# EAGLE design gondola_test (EAGLE 5.07)
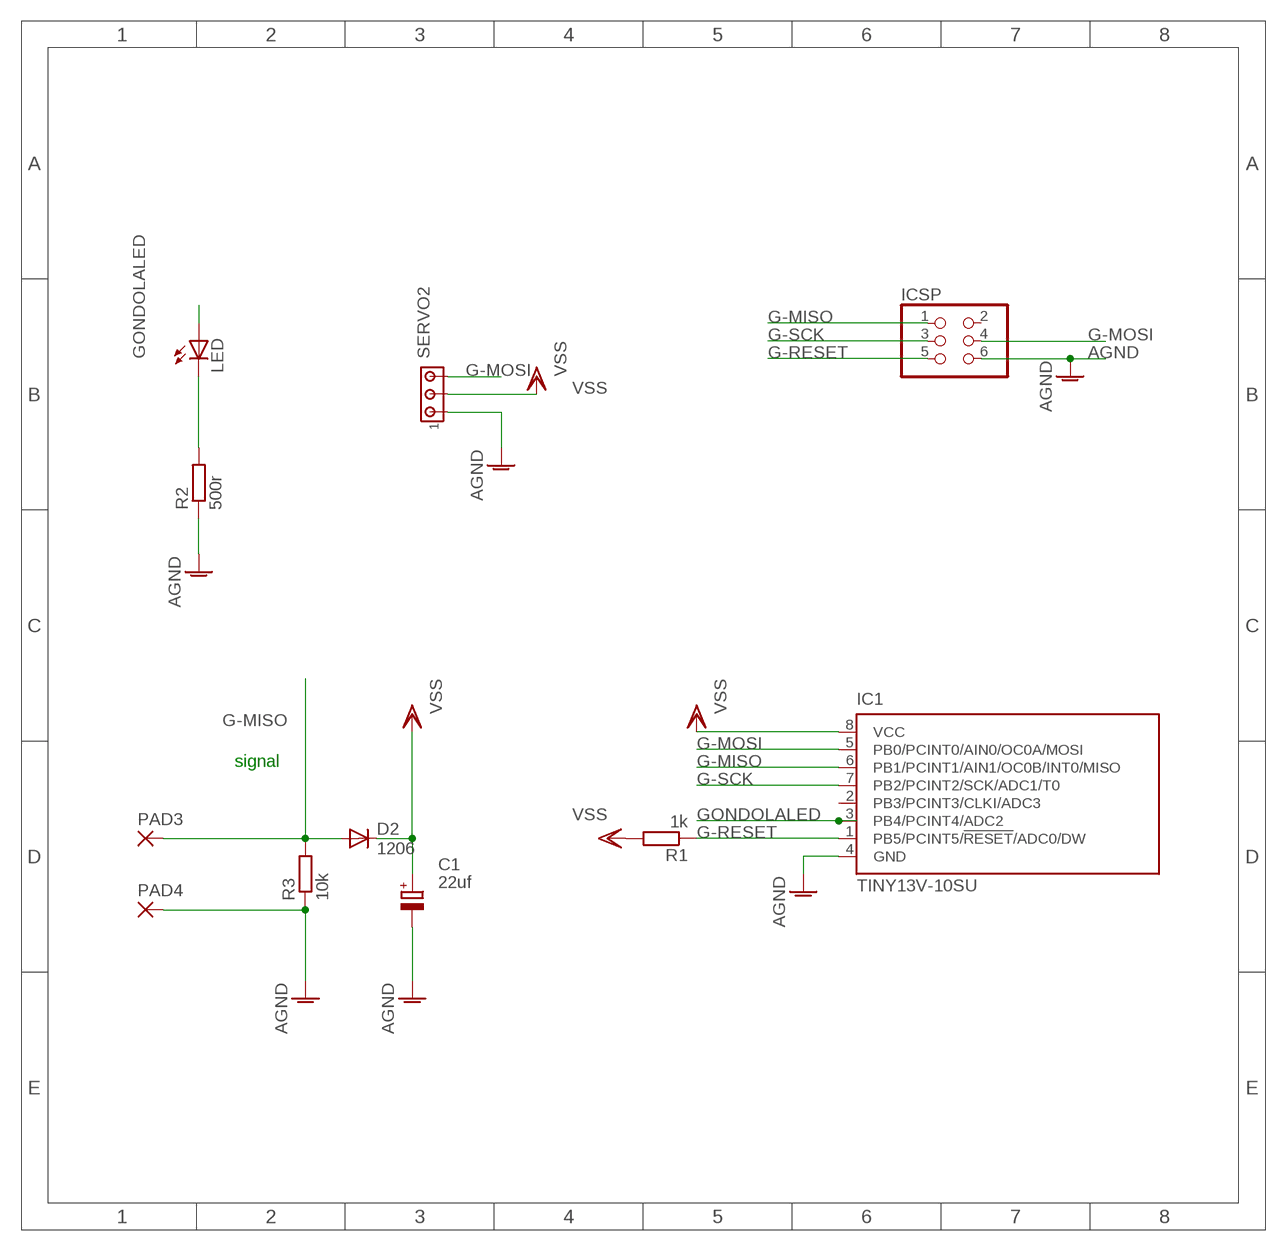
[diagram p0: schematic, sheet 1]

## Parts
C1  22uf  CPOL-EU140CLH-1014  [140CLH-1014]
D2  1206  DIODE-GF1  [GF1]
IC1  TINY13V-10SU  [8S2]
ICSP  PINHD-2X3  [2X03]
LED  LEDSMT1206  [1206]
PAD3  3,17/1,3  [3,17/1,3]
PAD4  3,17/1,3  [3,17/1,3]
R1  1k  R-EU_R1206  [R1206]
R2  500r  R-EU_R1206  [R1206]
R3  10k  R-EU_R1206  [R1206]
SERVO2  MTA03-100  [10X03MTA]

## Nets
AGND [power]: C1.- IC1.4(GND) ICSP.6 PAD4.1(P) R2.1 R3.1 SERVO2.1
G-MISO: D2.A IC1.6(PB1/PCINT1/AIN1/OC0B/INT0/MISO) ICSP.1 PAD3.1(P) R3.2
G-MOSI: IC1.5(PB0/PCINT0/AIN0/OC0A/MOSI) ICSP.4 SERVO2.3
G-RESET: IC1.1(PB5/PCINT5/!RESET!/ADC0/DW) ICSP.5 R1.1
G-SCK: IC1.7(PB2/PCINT2/SCK/ADC1/T0) ICSP.3
GONDOLALED: IC1.3(PB4/PCINT4/ADC2) LED.A
N$1: LED.C R2.2
VSS: C1.+ D2.C IC1.8(VCC) R1.2 SERVO2.2
Unconnected: IC1.2(PB3/PCINT3/CLKI/ADC3) ICSP.2

## Notes on the sheet
- signal

## Library data of the parts
C1 = rcl:CPOL-EU: POLARIZED CAPACITOR, European symbol
D2 = matt diode:DIODE-: DIODE
IC1 = atmel:TINY13: 8-bit AVR Microcontroller with 1K Bytes In-System Programmable Flash Source: http://www.atmel.com/dyn/resources/prod_documents/2535S.pdf; MPN: ATTINY13V-10SU; OC_FARNELL: 9171584; OC_NEWARK: 96K6524
ICSP = pinhead:PINHD-2X3: PIN HEADER
LED = matt led:LED: LED OSRAM: - CHIPLED LG R971, LG N971, LY N971, LG Q971, LY Q971, LO R971, LY R971 LH N974, LH R974 LS Q976, LO Q976, LY Q976 LO Q996 - Hyper CHIPLED LW Q18S LB Q993, LB Q99A, LB R99A - SideLED LS A670, LO A670, LY A670, LG A670, LP A670 LB A673, LV A673, LT A673, LW A673 LH A674 LY A675 LS A676, LA A676, LO A676, LY A676, LW A676 LS A679, LY A679, LG A679 - Hyper Micro SIDELED® LS Y876, LA Y876, LO Y876, LY Y876 LT Y87S - SmartLED LW L88C, LW L88S LB L89C, LB L89S, LG L890 LS L89K, LO L89K, LY L89K LS L896, LA L896, LO L896, LY L896 - TOPLED LS T670, LO T670, LY T670, LG T670, LP T670 LSG T670, LSP T670, LSY T670, LOP T670, LYG T670 LG T671, LOG T671, LSG T671 LB T673, LV T673, LT T673, LW T673 LH T674 LS T676, LA T676, LO T676, LY T676, LB T676, LH T676, LSB T676, LW T676 LB T67C, LV T67C, LT T67C, LS T67K, LO T67K, LY T67K, LW E67C LS E67B, LA E67B, LO E67B, LY E67B, LB E67C, LV E67C, LT E67C LW T67C LS T679, LY T679, LG T679 LS T770, LO T770, LY T770, LG T770, LP T770 LB T773, LV T773, LT T773, LW T773 LH T774 LS E675, LA E675, LY E675, LS T675 LS T776, LA T776, LO T776, LY T776, LB T776 LHGB T686 LT T68C, LB T68C - Hyper Mini TOPLED® LB M676 - Mini TOPLED Santana® LG M470 LS M47K, LO M47K, LY M47K Source: http://www.osram.convergy.de LUXEON: - LUMILED® LXK2-PW12-R00, LXK2-PW12-S00, LXK2-PW14-U00, LXK2-PW14-V00 LXK2-PM12-R00, LXK2-PM12-S00, LXK2-PM14-U00 LXK2-PE12-Q00, LXK2-PE12-R00, LXK2-PE12-S00, LXK2-PE14-T00, LXK2-PE14-U00 LXK2-PB12-K00, LXK2-PB12-L00, LXK2-PB12-M00, LXK2-PB14-N00, LXK2-PB14-P00, LXK2-PB14-Q00 LXK2-PR12-L00, LXK2-PR12-M00, LXK2-PR14-Q00, LXK2-PR14-R00 LXK2-PD12-Q00, LXK2-PD12-R00, LXK2-PD12-S00 LXK2-PH12-R00, LXK2-PH12-S00 LXK2-PL12-P00, LXK2-PL12-Q00, LXK2-PL12-R00 Source: www.luxeon.com KINGBRIGHT: KA-3528ASYC Source: www.kingbright.com
PAD3 PAD4 = wirepad:3,17/1,3: THROUGH-HOLE PAD
R1-R3 = matt rcl:R-EU_: RESISTOR, European symbol
SERVO2 = matt con-amp:MTA03-100: AMP connector

## Net classes
1 power: width 3 mm

## Board
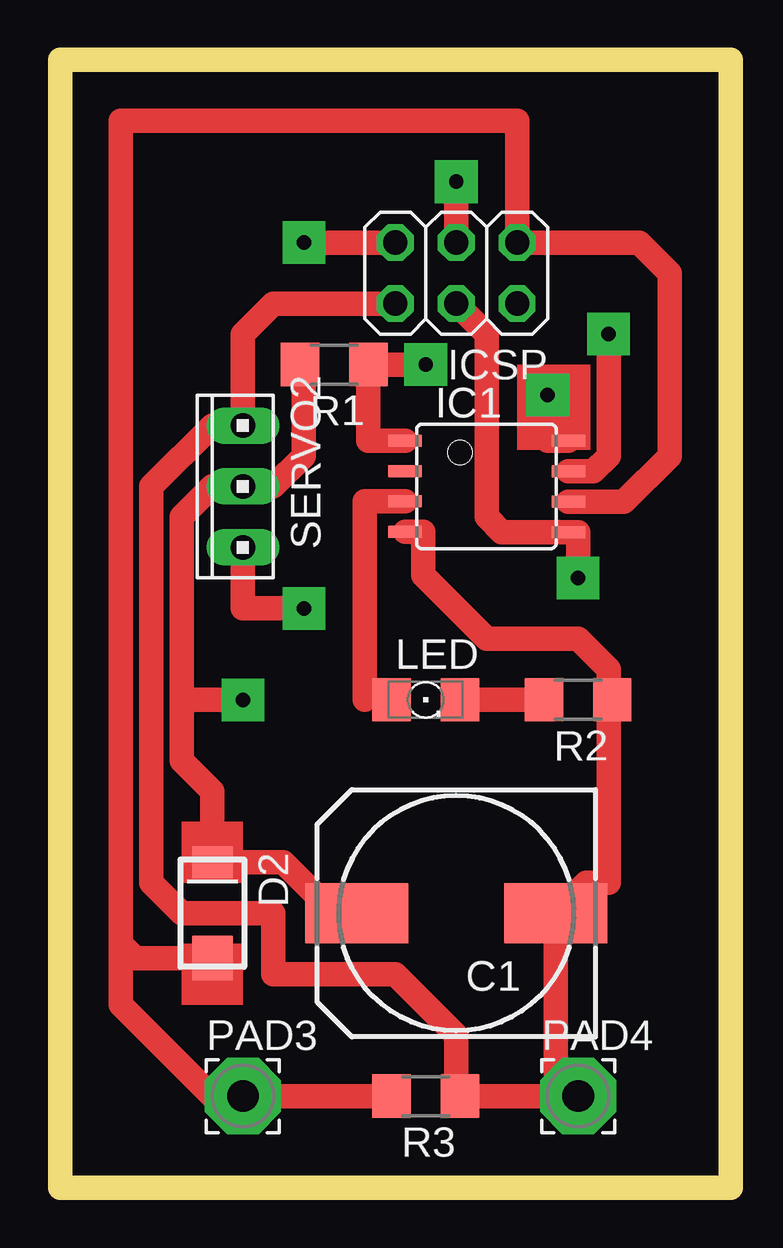
[diagram p1: board, top side]
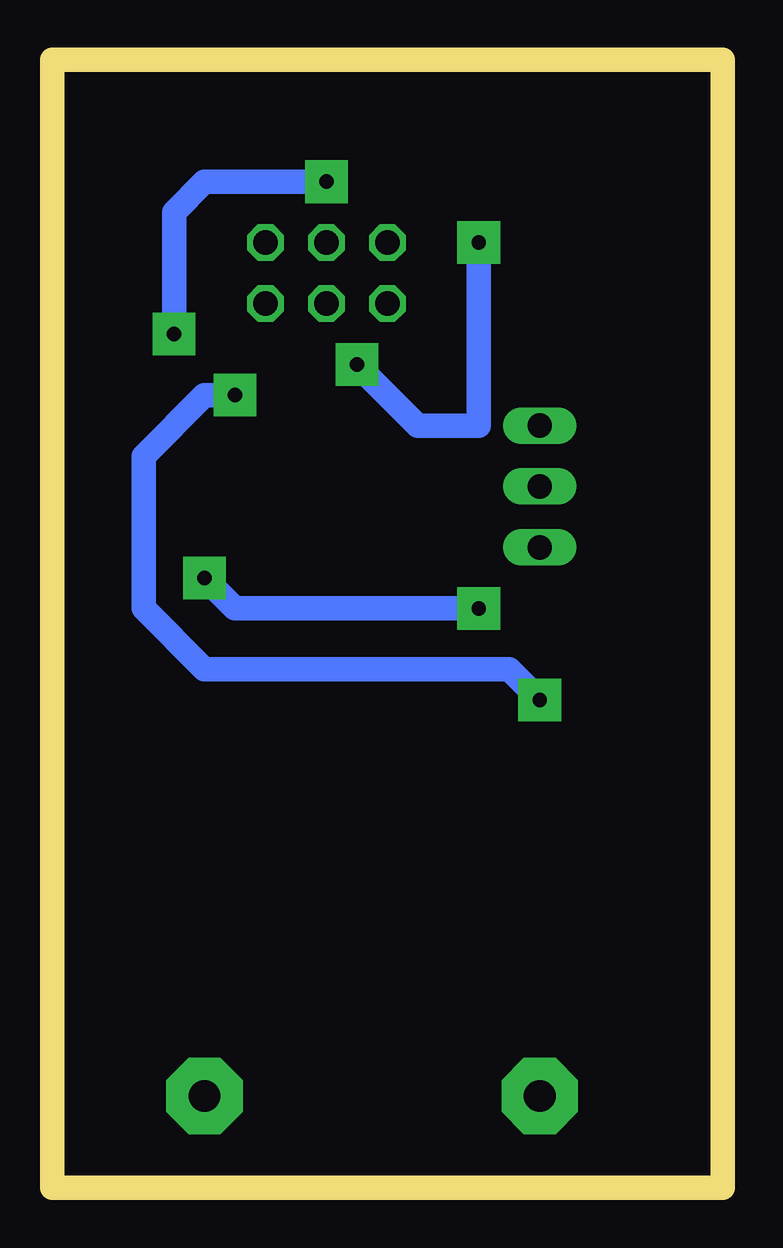
[diagram p2: board, bottom side, seen from below]

Size 27.61 x 46.98 mm. Coordinates in mm from the lower left corner, seen from the top.
Outline: 0,0 27.61,0 27.61,46.98 0,46.98 0,0
Copper layers (1*16): Top 0.035mm / dielectric 1.5mm / Bottom 0.035mm
Design rules "default": minimum track width 10mil, minimum drill 24mil, track to track 8mil, track to pad 8mil, pad to pad 8mil, via to via 8mil, smd to smd 8mil, copper to edge 40mil, drill to drill 8mil, minimum pad ring 10mil, minimum via ring 8mil, stop-mask expansion 4mil, vias tented up to drill 0mil, thermal gap 10mil
Milling: 4 lines

### Footprints (pad centres in the part's own frame; a part is rotated, then mirrored left to right if it is on the bottom)
140CLH-1014 = smd 4.3 x 2.5: + 4.15,0; - -4.15,0
GF1 = smd 1.85 x 1.68: A 1.87,0 | smd 1.32 x 1.68: C -2.12,0
8S2 = smd 0.5 x 1.4: 1 -1.905,-3.404; 2 -0.645,-3.404; 3 0.625,-3.404; 4 1.895,-3.404; 5 1.905,3.404; 6 0.635,3.404; 7 -0.635,3.404; 8 -1.905,3.404
2X03 = drill 1.016 octagon: 1 -2.54,-1.27; 2 -2.54,1.27; 3 0,-1.27; 4 0,1.27; 5 2.54,-1.27; 6 2.54,1.27
1206 = smd 1.6 x 1.803: A -1.422,0; C 1.422,0
3,17/1,3 = drill 1.321 pad 3.175 octagon: 1 0,0
R1206 = smd 1.6 x 1.803: 1 -1.422,0; 2 1.422,0
10X03MTA = drill 1.016 long: 1 2.54,0; 2 0,0; 3 -2.54,0

### Placement (x,y rotation side)
C1  16.51,11.43 180 top
D2  6.35,11.43 270 top
IC1  17.78,29.21 270 top
ICSP  16.51,38.1 180 top
LED  15.24,20.32 0 top
PAD3  7.62,3.81 0 top
PAD4  21.59,3.81 0 top
R1  11.43,34.29 180 top
R2  21.59,20.32 180 top
R3  15.24,3.81 180 top
SERVO2  7.62,29.21 90 top

### Tracks (layer width: path | path; a pad name or v marks a point on that pad's centre or on a via)
AGND
  Top 0.406: 22.86,20.32 R2.1 22.86,20.47 | PAD4.1 22.86,3.81 | 16.51,3.96 R3.1
  Top 1.016: R3.1 PAD4.1 20.66,4.74 C1.- 21.93,12.7 22.86,12.7 22.86,15.24 22.86,20.32 | 22.86,20.47 22.86,21.59 21.59,22.86 17.78,22.86 15.13,25.51 15.13,27.32 IC1.4 | 16.51,3.96 16.51,6.35 13.97,8.89 8.89,8.89 8.89,11.43 5.08,11.43 3.81,12.7 3.81,29.21 6.35,31.75 SERVO2.1 7.62,35.56 8.89,36.83 ICSP.6
G-MISO
  Top 1.016: R3.2 PAD3.1 6.35,3.81 2.54,7.62 2.54,10.16 | IC1.6 23.5,28.57 25.4,30.48 25.4,38.1 24.13,39.37 ICSP.1 19.05,44.45 2.54,44.45 2.54,10.16 | D2.A 3.14,9.56 2.54,10.16
G-MOSI  (via drill 0.6 pad 1.78)
  Top 1.016: ICSP.4 17.78,35.56 17.78,27.94 18.41,27.3 IC1.5 21.59,27.3 v21.59,25.4 | SERVO2.3 7.62,24.13 v10.16,24.13
  Bottom 1.016: v10.16,24.13 20.32,24.13 v21.59,25.4
G-RESET  (via drill 0.6 pad 1.78)
  Top 1.016: IC1.1 12.85,31.11 R1.1 v15.24,34.29 | v10.16,39.37 ICSP.5
  Bottom 1.016: v10.16,39.37 10.16,31.75 12.7,31.75 v15.24,34.29
G-SCK  (via drill 0.6 pad 1.78)
  Top 1.016: IC1.7 22.23,29.84 22.86,30.48 v22.86,35.56 | v16.51,41.91 ICSP.3
  Bottom 1.016: v16.51,41.91 21.59,41.91 22.86,40.64 v22.86,35.56
GONDOLALED
  Top 0.406: LED.A 12.7,20.32
  Top 1.016: IC1.3 12.7,28.59 12.7,20.32
N$1
  Top 1.016: LED.C R2.2
VSS  (via drill 0.6 pad 1.78)
  Top 0.406: 10.16,34.14 R1.2
  Top 1.016: 5.08,20.32 5.08,17.78 6.35,16.51 D2.C 9.31,13.55 11.43,11.43 C1.+ | 5.08,20.32 5.08,27.94 6.35,29.21 SERVO2.2 8.89,29.21 10.16,30.48 10.16,34.14 | 5.08,20.32 v7.62,20.32 | IC1.8 20.32,31.11 v20.32,33.02
  Bottom 1.016: v7.62,20.32 8.89,21.59 21.59,21.59 24.13,24.13 24.13,30.48 21.59,33.02 v20.32,33.02
(copper drawn outside any net)
  shapes: Top area x3